# EAGLE design mixer (EAGLE 9.6.2)
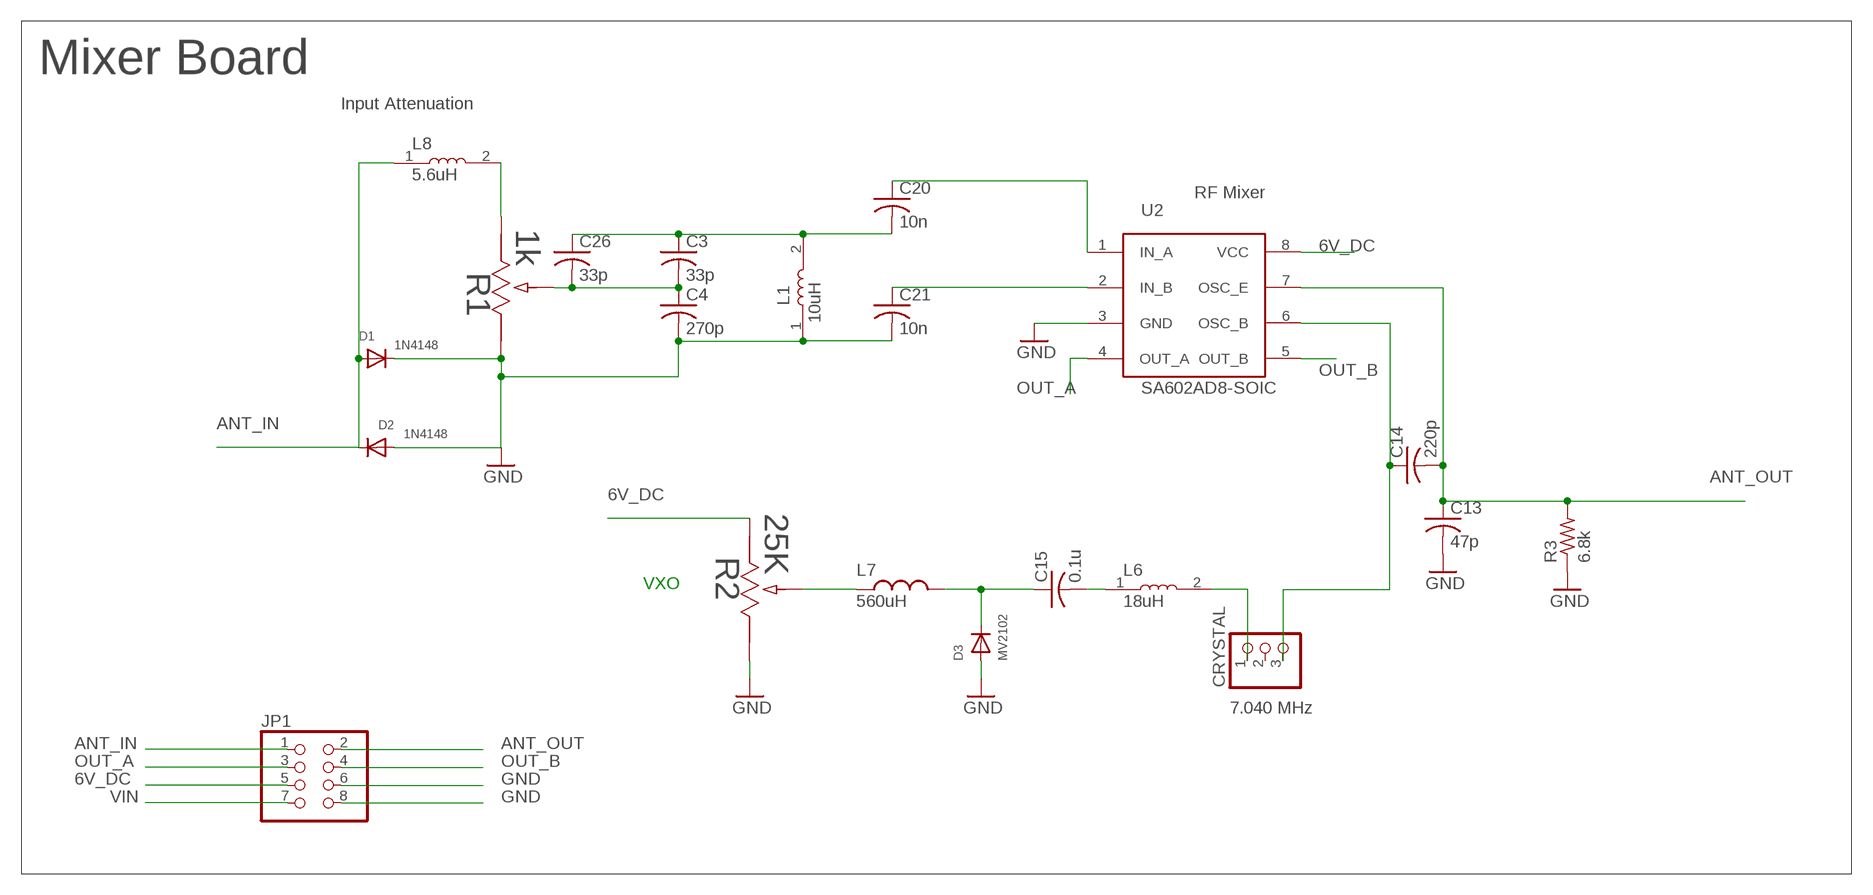
[diagram p0: schematic, sheet 1]

## Parts
C3  33p  C-USC0805  [C0805]
C4  270p  C-USC0805  [C0805]
C13  47p  C-USC0805  [C0805]
C14  220p  C-USC0805  [C0805]
C15  0.1u  C-USC0805  [C0805]
C20  10n  C-USC0805  [C0805]
C21  10n  C-USC0805  [C0805]
C26  33p  C-USC0805  [C0805]
CRYSTAL  PINHD-1X3  [1X03]
D1  1N4148  DIODE_SOD-123FL  [SOD-123FL]
D2  1N4148  DIODE_SOD-123FL  [SOD-123FL]
D3  MV2102  DIODESOD-323F  [SOD-323F]
JP1  PINHD-2X4  [2X04]
L1  10uH  MLF2012E5R6KT000  [INDC2012X87N]
L6  18uH  MLF2012E5R6KT000  [INDC2012X87N]
L7  560uH  LMOLDED-1812(4532-METRIC)  [INDM4532X32_W]
L8  5.6uH  MLF2012E5R6KT000  [INDC2012X87N]
R1  1k  3362W-1-102LF  [POT_3362W]
R2  25K  3362W-1-102LF  [POT_3362W]
R3  6.8k  R-US_M0805  [M0805]
U2  SA602AD8-SOIC  [SOIC127P599X175-8N]

## Nets
6V_DC [power]: JP1.5 R2.1 U2.8(VCC)
ANT_IN: D1.A D2.C JP1.1 L8.1
ANT_OUT: C13.1 C14.2 JP1.2 R3.2 U2.7(OSC_E)
GND: C4.2 C13.2 C21.2 D1.C D2.A D3.A JP1.6 JP1.8 L1.1 R1.3 R2.3 R3.1 U2.3(GND)
N$1: C20.1 U2.1(IN_A)
N$2: C21.1 U2.2(IN_B)
N$3: C3.1 C20.2 C26.1 L1.2
N$4: C14.1 CRYSTAL.3 U2.6(OSC_B)
N$5: C3.2 C4.1 C26.2 R1.2
N$6: L8.2 R1.1
N$15: CRYSTAL.1 L6.2
N$16: C15.2 L6.1
N$17: C15.1 D3.C L7.2
N$18: L7.1 R2.2
OUT_A: JP1.3 U2.4(OUT_A)
OUT_B: JP1.4 U2.5(OUT_B)
VIN [power]: JP1.7
Unconnected: CRYSTAL.2

## Notes on the sheet
- Mixer Board
- Input Attenuation
- RF Mixer
- VXO
- 7.040 MHz

## Library data of the parts
C3 C4 C13-C15 C20 C21 C26 = adafruit:C-US: CAPACITOR, American symbol
CRYSTAL = adafruit:PINHD-1X3: PIN HEADER
D1-D3 = adafruit:DIODE: Diode SMADIODE - SMA Surface Mount Package 20V 1A Schottky Diode Digikey: 641-1014-6-ND DO-1N4148 - Through Hole Small Current Diode SOD-123 20V 1 A (.5mV Vf) Schottky Diode - Digikey: MBRX120TPMSCT-ND SOD-323 10V 570mA (.38mV Vf, 3ns) Schottky Diode - Digikey: ZLLS410CT-ND SOD-523 30V 30mA Schottky Diode (RB751S-40TE61) - Digikey: RB751S-40TE61CT-ND SOT23-R/W - SOT23 Package (R = Solder Paste/Reflow Ovens, W = Hand-Soldering) BAT54Film 40V 300mA - Digikey: 497-7162-1-ND
JP1 = adafruit:PINHD-2X4: PIN HEADER
L1 L6 L8 = MLF2012E5R6KT000:MLF2012E5R6KT000: MLF Series 0805 5.6 uH ±10 % Tol. 15 mA Magnetic Shielded Multilayer Inductor; DESCRIPTION: Inductor RF Chip Shielded Multi-Layer 5.6uH 10% 4MHz 50Q-Factor Ferrite 15mA 600mOhm DCR 0805 T/R; MF: TDK; MP: MLF2012E5R6KT000; PACKAGE: 0805 TDK
L7 = zort2:L: Inductor Fixed - Generic
R1 R2 = zort2:3362W-1-102LF; BUILT_BY: EMA_UL_Team; MANUFACTURER_PART_NUMBER: 3362W-1-102LF; SOURCELIBRARY: Bourns_2012-08-08; VENDOR: Bourns Electronics
R3 = adafruit:R-US_: RESISTOR, American symbol
U2 = zort2:SA602AD

## Net classes
1 power: width 0.305 mm

## Board
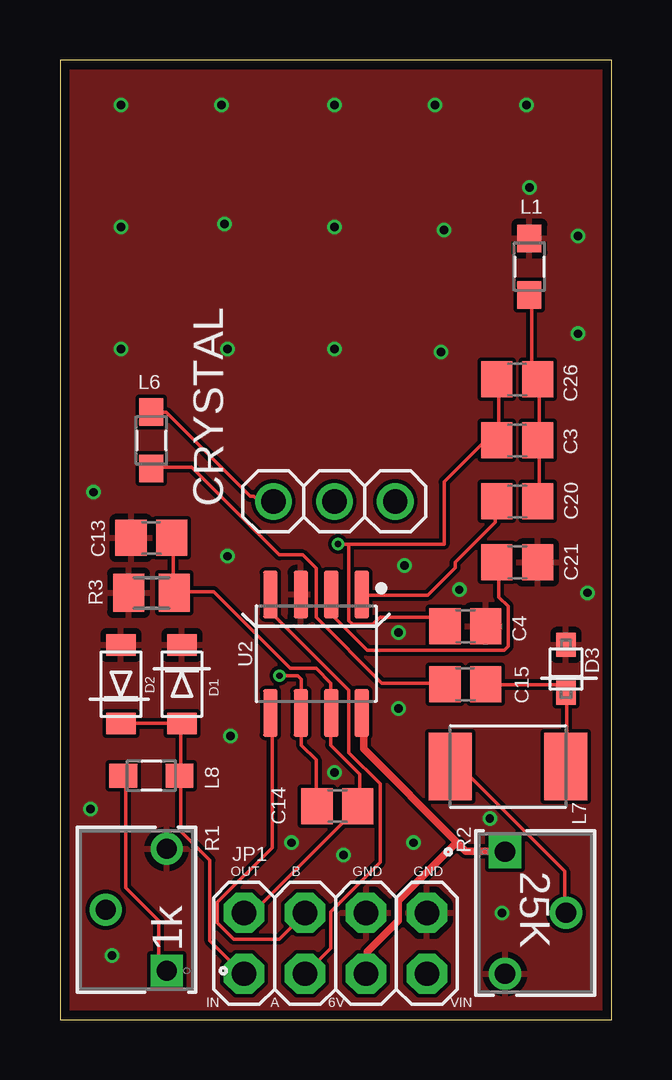
[diagram p1: board, top side]
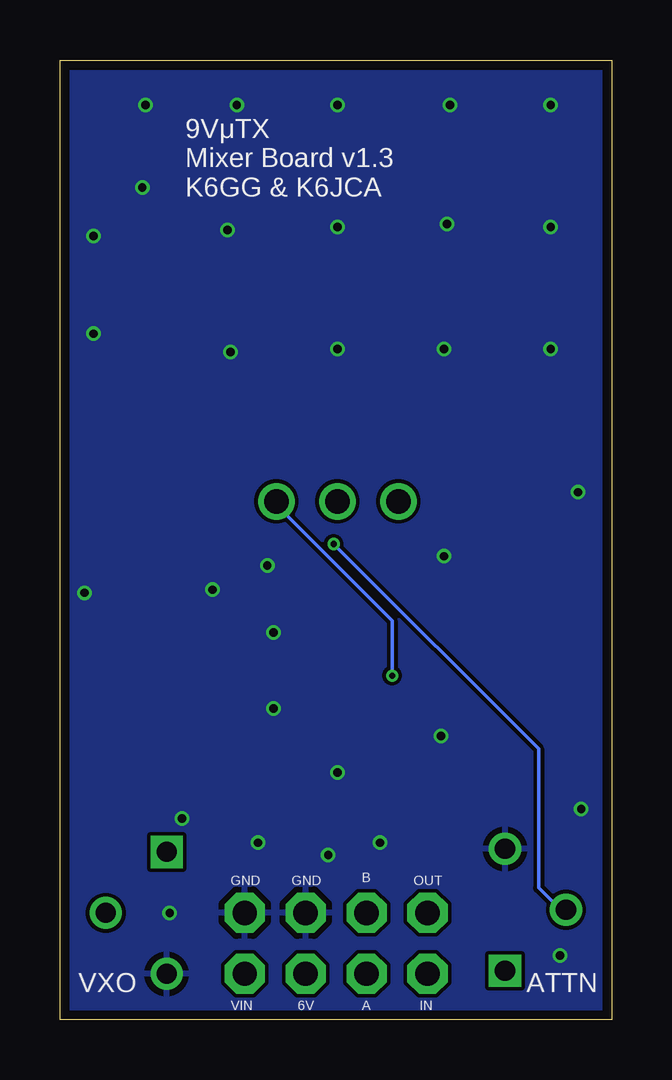
[diagram p2: board, bottom side, seen from below]

Size 22.99 x 39.98 mm. Coordinates in mm from the lower left corner, seen from the top.
Outline: 0,0 22.99,0 22.99,39.98 0,39.98 0,0
Copper layers (1*16): Top 0.035559375mm / dielectric 1.6mm / Bottom 0.035559375mm
Design rules "oshpark-2layer": minimum track width 6mil, minimum drill 10mil, track to track 6mil, track to pad 6mil, pad to pad 6mil, via to via 6mil, smd to smd 6mil, copper to edge 15mil, drill to drill 6mil, minimum pad ring 5mil, minimum via ring 5mil, stop-mask expansion 2.5mil, vias tented up to drill 0mil, thermal gap 10mil

### Footprints (pad centres in the part's own frame; a part is rotated, then mirrored left to right if it is on the bottom)
C0805 = smd 1.3 x 1.5: 1 -0.85,0; 2 0.85,0
1X03 = drill 1.016: 1 -2.54,0; 2 0,0; 3 2.54,0
SOD-123FL = smd 0.91 x 1.22: A 1.637,0; C -1.637,0
SOD-323F = smd 1 x 0.8: A -1,0; C 1,0
2X04 = drill 1.016 pad 1.676 octagon: 1 -3.81,-1.27; 2 -3.81,1.27; 3 -1.27,-1.27; 4 -1.27,1.27; 5 1.27,-1.27; 6 1.27,1.27; 7 3.81,-1.27; 8 3.81,1.27
INDC2012X87N = smd 1.15 x 1: 1 -1.175,0; 2 1.175,0
INDM4532X32_W = smd 1.793 x 2.799: 1 -2.4,0; 2 2.4,0
POT_3362W = drill 0.838 pad 1.346 square: 1 0,0 | drill 0.838 pad 1.346: 2 2.54,2.54; 3 5.08,0
M0805 = smd 1.3 x 1.6: 1 -0.95,0; 2 0.95,0
SOIC127P599X175-8N = smd 1.965 x 0.602: 1 -2.47,1.905; 2 -2.47,0.635; 3 -2.47,-0.635; 4 -2.47,-1.905; 5 2.47,-1.905; 6 2.47,-0.635; 7 2.47,0.635; 8 2.47,1.905

### Placement (x,y rotation side)
C3  19.05,24.13 180 top
C4  16.89,16.38 0 top
C13  3.81,20.07 180 top
C14  11.56,8.89 0 top
C15  16.89,13.97 180 top
C20  19.05,21.59 0 top
C21  19.05,19.05 0 top
C26  19.05,26.67 180 top
CRYSTAL  11.43,21.59 0 top
D1  5.08,13.97 270 top
D2  2.54,13.97 90 top
D3  21.08,14.61 270 top
JP1  11.48,3.17 0 top
L1  19.56,31.37 270 top
L6  3.81,24.13 90 top
L7  18.67,10.54 0 top
L8  3.81,10.16 180 top
R1  4.45,2.03 90 top
R2  18.54,6.99 270 top
R3  3.81,17.78 0 top
U2  10.67,15.24 270 top

### Tracks (layer width: path | path; a pad name or v marks a point on that pad's centre or on a via)
6V_DC
  Top 0.305: 16.54,7.39 16.92,7.01 18.52,7.01 R2.1 | 16.54,7.39 12.65,11.28 12.65,12.57 U2.8 | 16.54,7.39 14.1,4.95 14.1,4.12 12.8,2.82 12.8,1.91 JP1.5
ANT_IN
  Top 0.152: D2.C 2.59,12.34 5.03,12.34 D1.A 5.03,12.19 5.03,10.21 L8.1 5.03,10.06 5.03,7.85 6.25,6.63 6.25,3.28 7.62,1.91 JP1.1
ANT_OUT
  Top 0.152: C13.1 4.72,19.96 4.72,17.83 R3.2 4.88,17.83 6.4,17.83 9.6,14.63 10.67,14.63 11.28,14.02 11.28,12.8 U2.7 11.28,12.65 11.28,11.43 12.5,10.21 12.5,8.99 C14.2 | 12.95,8.84 12.5,8.84 C14.2 | JP1.2 7.7,4.5 8.08,4.5 12.42,8.84 C14.2
GND  (via drill 0.35)
  other vias: 2.54,38.1 2.54,33.02 2.54,27.94 11.43,38.1 11.43,33.02 11.43,27.94 19.43,38.1 19.56,34.67 14.35,18.92 16.64,17.91 21.97,17.78 11.43,10.29 14.1,12.95 9.65,7.37 11.81,6.86 14.73,7.37 14.1,16.13 17.91,8.38 6.99,19.3 7.11,11.81 1.4,21.97 1.27,8.76 2.16,2.67 18.41,4.45 6.86,33.15 6.73,38.1 6.99,27.94 16,32.89 15.88,27.81 15.62,38.1 21.59,28.57 21.59,32.64
  pour Top: 0.38,39.62 0.38,0.38 22.73,0.38 22.73,39.62
  pour Bottom: 0.38,39.5 0.38,0.38 22.61,0.38 22.61,39.5
N$1
  Top 0.152: 18.14,21.49 C20.1 18.14,21.41 18.14,20.73 16.46,19.05 16.46,18.82 15.32,17.68 12.72,17.68 U2.1 12.65,17.68
N$2
  Top 0.152: 18.14,19.66 18.14,19.05 C21.1 18.29,19.05 18.29,17.6 18.67,17.22 18.67,15.54 18.52,15.39 12.8,15.39 11.28,16.92 11.28,17.6 U2.2 | 11.28,17.83 U2.2 | 11.28,17.68 U2.2
N$3
  Top 0.152: C20.2 19.96,21.64 19.96,24.08 C3.1 19.96,24.23 19.96,26.67 C26.1 19.81,26.67 19.66,26.82 19.66,30.18 L1.2
N$4  (via drill 0.25)
  Top 0.152: 9.91,12.8 U2.6 | C14.1 10.67,8.99 10.67,10.82 10.06,11.43 10.06,12.65 U2.6 | v9.14,14.33 9.91,14.33 10.06,14.17 10.06,12.8 U2.6
  Bottom 0.152: v9.14,14.33 9.14,16.61 14.02,21.49 CRYSTAL.3
N$5  (via drill 0.25)
  Top 0.152: 16,16.46 C4.1 | C26.2 18.29,26.67 18.29,24.23 C3.2 18.14,24.08 17.68,24.08 16,22.4 16,19.81 12.04,19.81 | 12.04,19.81 v11.58,19.81 | 12.04,19.81 12.04,16.61 12.19,16.46 13.03,16.46 13.34,16.76 15.66,16.76 C4.1 | 15.93,16.46 C4.1
  Bottom 0.152: v11.58,19.81 3.05,11.28 3.05,5.49 2.44,4.88 2.29,4.88 1.98,4.57 R1.2
N$6
  Top 0.152: L8.2 2.74,10.06 2.74,5.49 4.12,4.12 4.12,2.44 4.42,2.13 R1.1
N$15
  Top 0.152: L6.2 4.42,25.3 7.92,21.79 8.08,21.79 8.23,21.64 8.84,21.64 CRYSTAL.1
N$16
  Top 0.152: L6.1 3.81,23.01 5.49,23.01 9.14,19.36 10.11,19.36 10.67,18.8 10.67,16.76 13.41,14.02 16,14.02 C15.2
N$17
  Top 0.152: 20.95,13.74 D3.C | D3.C 21.11,13.56 21.11,10.59 L7.2 | C15.1 17.75,13.95 20.65,13.95 20.88,13.72 D3.C
N$18
  Top 0.152: R2.2 21.03,4.5 21.03,6.17 16.69,10.52 16.31,10.52 L7.1
OUT_A
  Top 0.152: U2.4 8.84,17.68 8.84,16.92 12.04,13.72 12.04,11.12 13.34,9.83 13.34,6.55 11.28,4.5 11.28,2.97 JP1.3
OUT_B
  Top 0.152: 8.84,12.65 U2.5 8.84,12.57 8.84,7.16 6.55,4.88 6.55,4.04 7.24,3.35 9.14,3.35 10.21,4.42 JP1.4

### Text on the board
tNames: OUT | B | GND | GND | IN | A | 6V | VIN
bNames: 9VμTX / Mixer Board v1.3 / K6GG & K6JCA | OUT | B | GND | GND | ATTN | VXO | IN | A | 6V | VIN